# Altium project CAN_C.PrjPcb
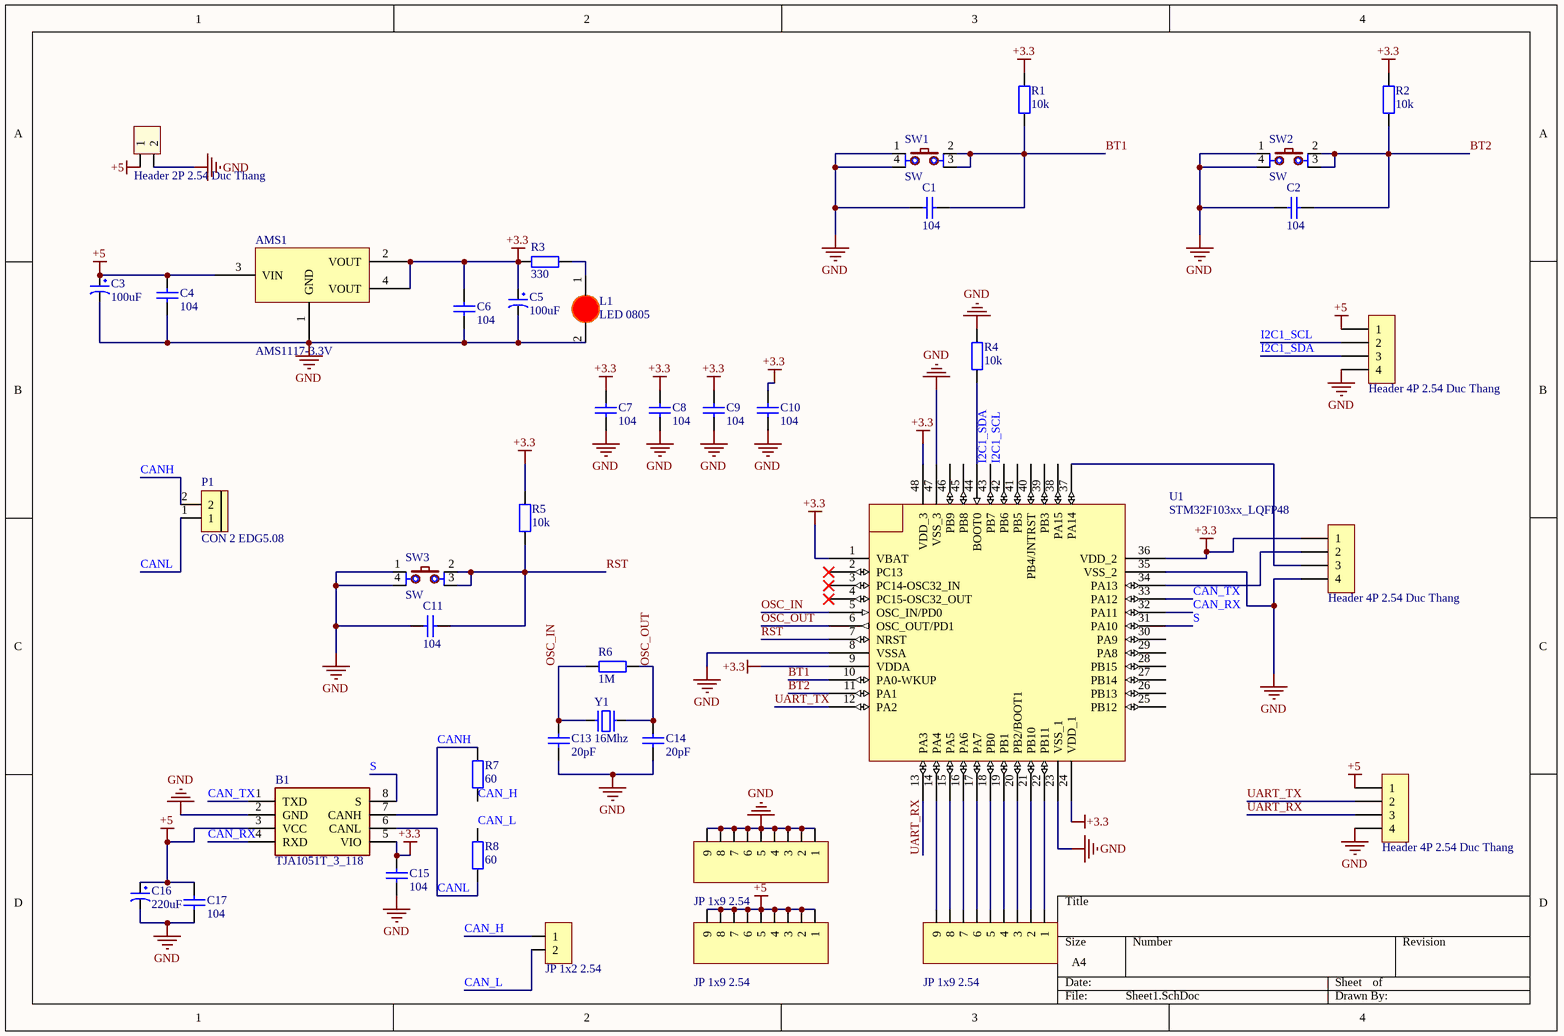
[diagram p0: Sheet1.SchDoc]
1 sheet, 41 parts. Net scope: global (net labels, ports and power ports of the same name join across sheets).
Board file: PCB1.PcbDoc

## Sheet Sheet1.SchDoc
size A4; SheetNumber: 1; SheetTotal: 1

### Parts
AMS1  AMS1117-3.3V  [SOT223]
B1  TJA1051T_3_118  [SOIC127P600X175-8N]
C1  104  [tu 0805]
C2  104  [tu 0805]
C3  100uF  [tu hoa 5mm]
C4  104  [tu 0805]
C5  100uF  [tu hoa 5mm]
C6  104  [tu 0805]
C7  104  [tu 0805]
C8  104  [tu 0805]
C9  104  [tu 0805]
C10  104  [tu 0805]
C11  104  [tu 0805]
C13  20pF  [tu 0805]
C14  20pF  [tu 0805]
C15  104  [tu 0805]
C16  220uF  [tu hoa 16mm]
C17  104  [tu 0805]
H1  Header 2P 2.54 Duc Thang  [XH2.54M-2]
H2  Header 4P 2.54 Duc Thang  [XH2.54M-4]
H3  Header 4P 2.54 Duc Thang  [XH2.54M-4]
H4  Header 4P 2.54 Duc Thang  [XH2.54M-4]
JP1  JP 1x9 2.54  [JP 1x9 DT]
JP2  JP 1x9 2.54  [JP 1x9 DT]
JP3  JP 1x9 2.54  [JP 1x9 DT]
JP5  JP 1x2 2.54  [JP 1x2 DT]
L1  LED 0805  [LED-0805-Red]
P1  CON 2 EDG5.08  [CON 2 2EDG5.08]
R1  10k  [tro smd 0805]
R2  10k  [tro smd 0805]
R3  330  [tro smd 0805]
R4  10k  [tro smd 0805]
R5  10k  [tro smd 0805]
R6  1M  [tro smd 0805]
R7  60  [tro smd 0805]
R8  60  [tro smd 0805]
SW1  SW  [SW2-DIP]
SW2  SW  [SW2-DIP]
SW3  SW  [SW2-DIP]
U1  STM32F103xx_LQFP48  [STM32_LQPF48]
Y1  16Mhz  [Thach Anh 2 chan cam]

### Nets
+3.3: AMS1.2(VOUT) AMS1.4(VOUT) B1.5(VIO) C5.1 C6.1 C7.1 C8.1 C9.1 C10.1 C15.1 H3.1 R1.2 R2.2 R3.2 R5.2 U1.1(VBAT) U1.9(VDDA) U1.24(VDD_1) U1.36(VDD_2) U1.48(VDD_3)
+5: AMS1.3(VIN) B1.3(VCC) C3.1 C4.1 C16.1 C17.1 H1.1 H2.1 H4.1 JP3.1 JP3.2 JP3.3 JP3.4 JP3.5 JP3.6 JP3.7 JP3.8 JP3.9
GND: AMS1.1(GND) B1.2(GND) C1.1 C2.1 C3.2 C4.2 C5.2 C6.2 C7.2 C8.2 C9.2 C10.2 C11.1 C13.2 C14.2 C15.2 C16.2 C17.2 H1.2 H2.4 H3.4 H4.4 JP2.1 JP2.2 JP2.3 JP2.4 JP2.5 JP2.6 JP2.7 JP2.8 JP2.9 L1.2(K) R4.2 SW1.1 SW1.4 SW2.1 SW2.4 SW3.1 SW3.4 U1.8(VSSA) U1.23(VSS_1) U1.35(VSS_2) U1.47(VSS_3)
BT1: C1.2 R1.1 SW1.2 SW1.3 U1.10(PA0-WKUP)
BT2: C2.2 R2.1 SW2.2 SW2.3 U1.11(PA1)
CAN_H: JP5.1 R7.1
CAN_L: JP5.2 R8.2
CAN_RX: B1.4(RXD) U1.32(PA11)
CAN_TX: B1.1(TXD) U1.33(PA12)
CANH: B1.7(CANH) P1.2 R7.2
CANL: B1.6(CANL) P1.1 R8.1
I2C1_SCL: H2.2 U1.42(PB6)
I2C1_SDA: H2.3 U1.43(PB7)
OSC_IN: C13.1 R6.2 U1.5(OSC_IN/PD0) Y1.1
OSC_OUT: C14.1 R6.1 U1.6(OSC_OUT/PD1) Y1.2
RST: C11.2 R5.1 SW3.2 SW3.3 U1.7(NRST)
S: B1.8(S) U1.31(PA10)
UART_RX: H4.3 U1.13(PA3)
UART_TX: H4.2 U1.12(PA2)
NetH3_2: H3.2 U1.34(PA13)
NetH3_3: H3.3 U1.37(PA14)
NetJP1_1: JP1.1 U1.22(PB11)
NetJP1_2: JP1.2 U1.21(PB10)
NetJP1_3: JP1.3 U1.20(PB2/BOOT1)
NetJP1_4: JP1.4 U1.19(PB1)
NetJP1_5: JP1.5 U1.18(PB0)
NetJP1_6: JP1.6 U1.17(PA7)
NetJP1_7: JP1.7 U1.16(PA6)
NetJP1_8: JP1.8 U1.15(PA5)
NetJP1_9: JP1.9 U1.14(PA4)
NetL1_1: L1.1(A) R3.1
NetR4_1: R4.1 U1.44(BOOT0)

Not connected (* = marked no-connect by the designer): U1 2(PC13)* 3(PC14-OSC32_IN)* 4(PC15-OSC32_OUT)* 25(PB12) 26(PB13) 27(PB14) 28(PB15) 29(PA8) 30(PA9) 38(PA15) 39(PB3) 40(PB4/JNTRST) 41(PB5) 45(PB8) 46(PB9)

### Library data of the parts
AMS1 = AMS1117 SMD: Dán; Value: AMS1117-3.3V SOT223; Don_Vi: Con; Ma_Hang: MH000596; Ghi_Chu: *; Kieu_Chan: *; Chung_Loai: Dán
B1 = TJA1051T_3_118: CAN Interface IC Hi Spd CAN Transcvr 4.5V-5.5V 250ns; Manufacturer_Name: NXP; Manufacturer_Part_Number: TJA1051T/3,118; Geometry.Height: 1.75mm; Mouser Part Number: 771-TJA1051T3118; Mouser Price/Stock: https://www.mouser.co.uk/ProductDetail/NXP-Semiconductors/TJA1051T-3118?qs=O%2F7ihdSJpebv1PFlp05wnQ%3D%3D; Datasheet Link: http://www.nxp.com/docs/en/data-sheet/TJA1051.pdf
C1 C2 C4 C6-C11 C13-C15 C17 = Tu 0805 104 50V 10%: Dán; Don_Vi: Con; So_Chan: 2; Ten_Linh_Kien: Tụ 0805 104-100nF 10% 50V; Ma_Hang: MH004551; Chung_Loai: Dán; Kieu_Chan: *
C3 C5 = Tu Hoa 100uF 16V 5x7: Cắm; Don_Vi: Con; So_Chan: 2; Ten_Linh_Kien: Tụ Hóa 100uF 16V 5x7MM; Ma_Hang: MH001347; Chung_Loai: Cắm; Kieu_Chan: *
C16 = Tu Hoa 220uF 200V 15x35: Cắm; So_Chan: 2; Don_Vi: Con; Ten_Linh_Kien: Tụ Hóa 220uF 200V 15x35MM; Ma_Hang: MH004819; Chung_Loai: Cắm; Kieu_Chan: *
H1 = Header 2P 2.54 Duc Thang: Cắm; Ten_Linh_Kien: Header 2P XH2.54-2P Đực Thẳng; Don_Vi: Con; Ma_Hang: MH001283; Chung_Loai: Cắm
H2-H4 = Header 4P 2.54 Duc Thang: Cắm; Ten_Linh_Kien: Header 4P XH2.54-4P Đực Thẳng; Don_Vi: Con; Ma_Hang: MH001285; Chung_Loai: Cắm
JP1-JP3 = JP 1x9 2.54 Duc Thang: Cắm; Ten_Linh_Kien: Jump Đơn Đực 2.54MM 1x40P Thẳng 11MM; Don_Vi: Con; Ma_Hang: MH000903; Ghi_Chu: *; Kieu_Chan: *; Chung_Loai: Cắm
JP5 = JP 1x2 2.54 Duc Thang: Cắm; Ten_Linh_Kien: Jump Đơn Đực 2.54MM 1x40P Thẳng 11MM; Don_Vi: Con; Ma_Hang: MH000903; Ghi_Chu: *; Kieu_Chan: *; Chung_Loai: Cắm
L1 = LED 0805 Do: Dán; Don_Vi: Con; Ma_Hang: MH000897; Ten_Linh_Kien: LED 0805 Màu Đỏ (Red); Ghi_Chu: *; Kieu_Chan: *; Chung_Loai: Dán
P1 = CON 2 EDG5.08: Cắm; Ten_Linh_Kien: CON 2 2EDG5.08-2P 5.08MM ( Xanh Cong); Ma_Hang: MH000759; Ghi_Chu: *; Don_Vi: Con; Kieu_Chan: *; Chung_Loai: Cắm
R1-R8 = Tro 0805 1% 18k: Dán; Don_Vi: Con; So_Chan: 2; Ten_Linh_Kien: Trở 0805 1% 18k; Ma_Hang: MH005477; Chung_Loai: Dán; Kieu_Chan: *
SW1-SW3 = SW4: Switch button 4 pin; Value: Button chip 4 pin
Y1 = Thach Anh 2 chan Cam: Crystal For all Crystal 2pin.; Value: 4Mhz
U1 = STM32F103xx_LQFP48: Published: 30-May-2008; DatasheetVersion: rev6, Mar-2008; PackageVersion: Mar-2008; PackageReference: LQFP48; Publisher: Altium Limited; PackageDescription: 48-Pin Low-Profile Quad Flat Pack, 7 x 7 mm Body, 0.5 mm Pitch (LQFP48); ComponentLink1Description: Manufacturer Link; ComponentLink1URL: www.st.com/stm32; ComponentLink2Description: Datasheet; ComponentLink2URL: http://www.st.com/stonline/products/literature/ds/13587.pdf